# EAGLE design io_rtc_ide (EAGLE 5.11)
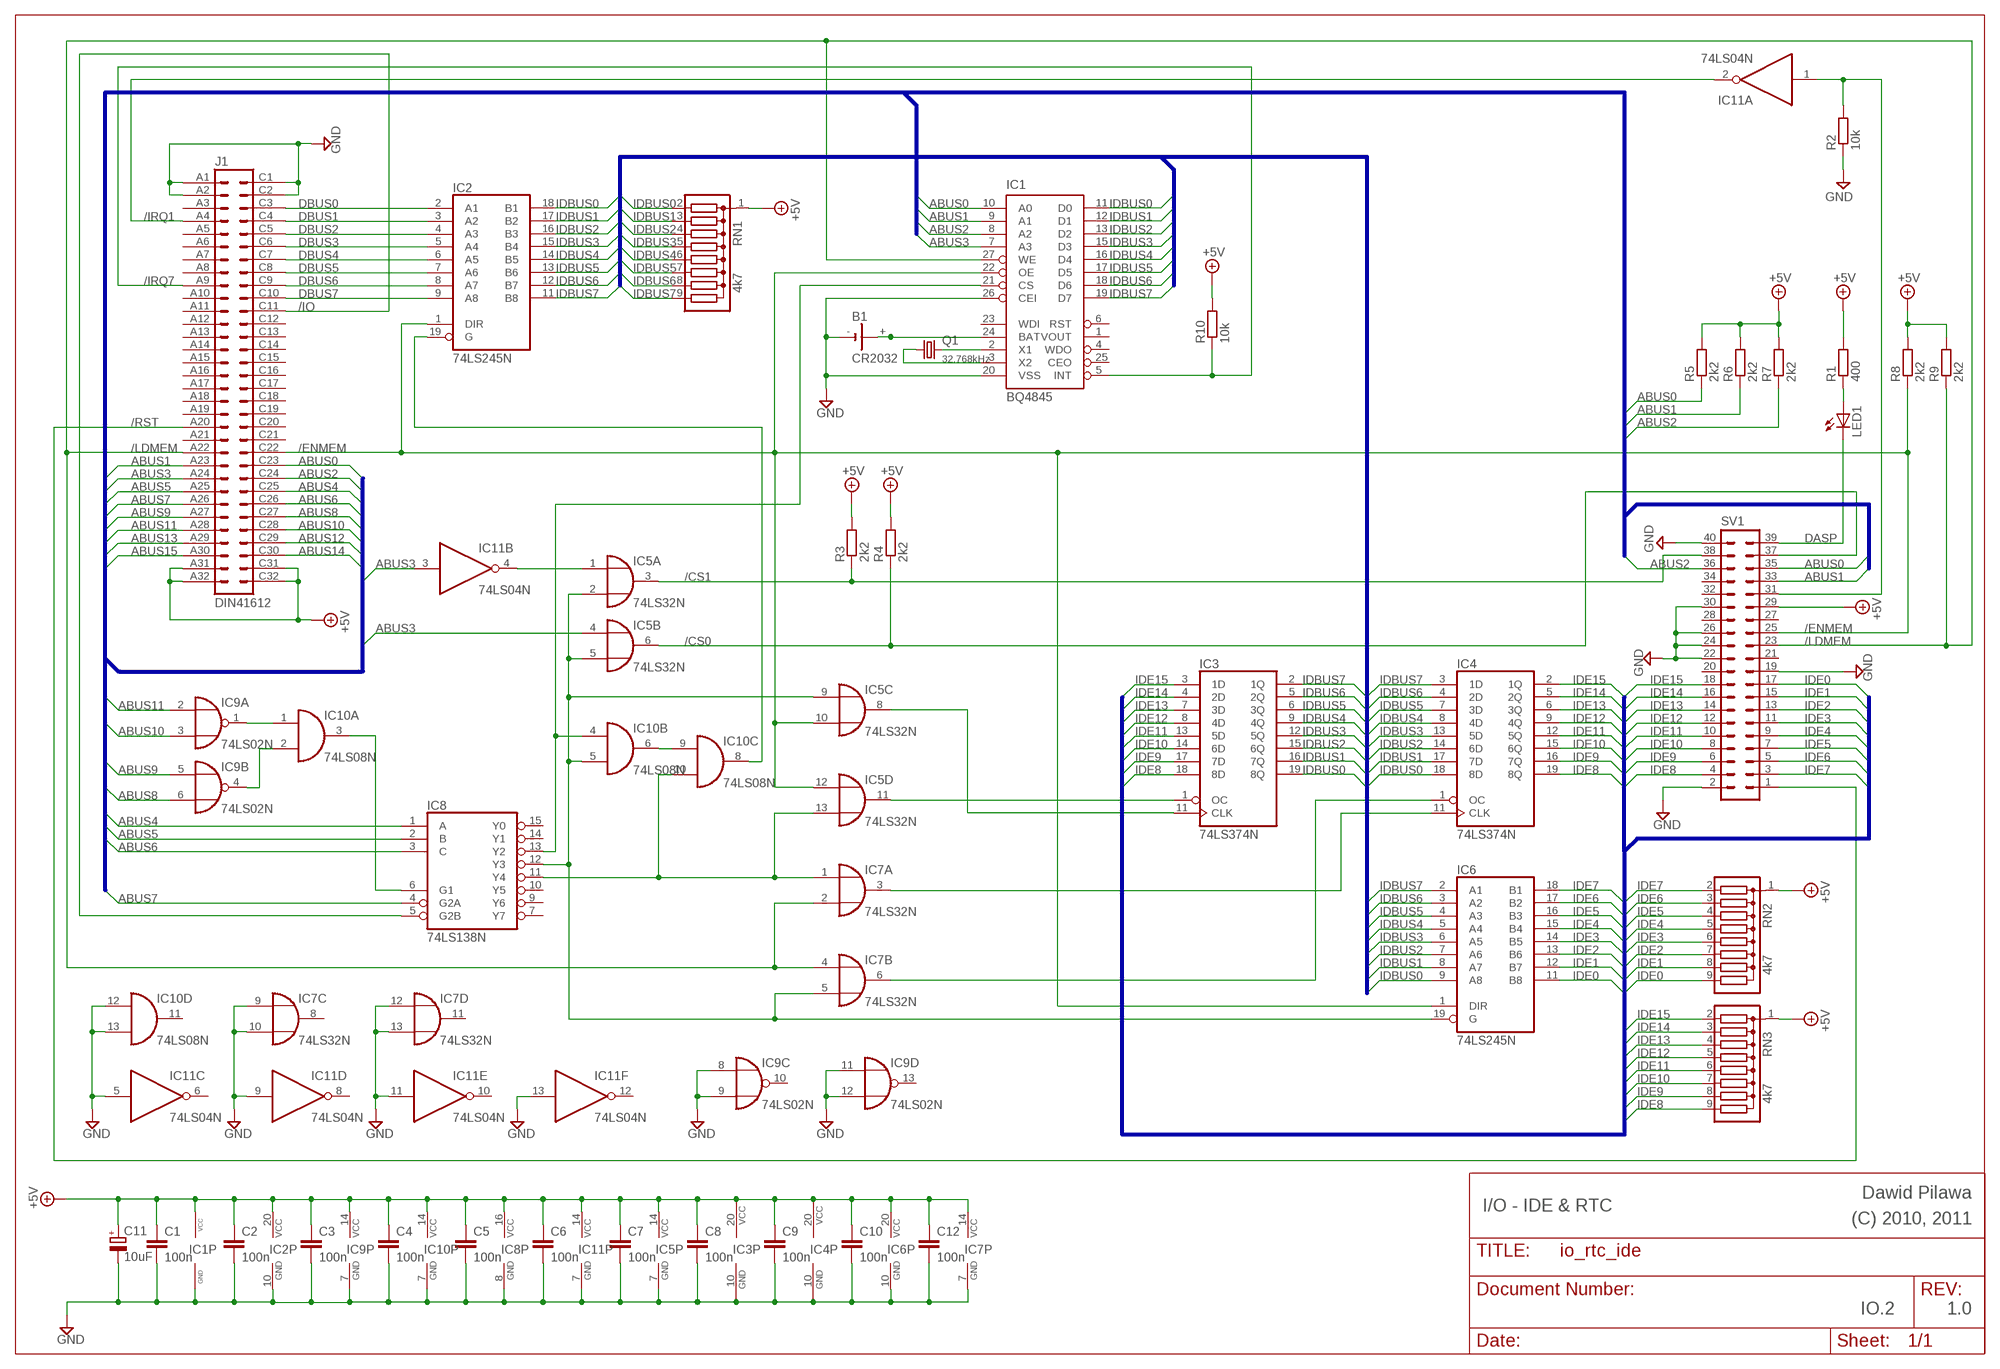
[diagram p0: schematic, sheet 1]

## Parts
B1  CR2032  [CR2032]
C1  100n  C-EU050-024X044  [C050-024X044]
C2  100n  C-EU050-024X044  [C050-024X044]
C3  100n  C-EU050-024X044  [C050-024X044]
C4  100n  C-EU050-024X044  [C050-024X044]
C5  100n  C-EU050-024X044  [C050-024X044]
C6  100n  C-EU050-024X044  [C050-024X044]
C7  100n  C-EU050-024X044  [C050-024X044]
C8  100n  C-EU050-024X044  [C050-024X044]
C9  100n  C-EU050-024X044  [C050-024X044]
C10  100n  C-EU050-024X044  [C050-024X044]
C11  10uF  CPOL-EUE5-5  [E5-5]
C12  100n  C-EU050-024X044  [C050-024X044]
IC1  BQ4845  BQ4845DIL28-6  [DIL28-6]
IC2  74LS245N  [DIL20]
IC3  74LS374N  [DIL20]
IC4  74LS374N  [DIL20]
IC5  74LS32N  [DIL14]
IC6  74LS245N  [DIL20]
IC7  74LS32N  [DIL14]
IC8  74LS138N  [DIL16]
IC9  74LS02N  [DIL14]
IC10  74LS08N  [DIL14]
IC11  74LS04N  [DIL14]
J1  DIN41612  VG64B  [VG64B]
LED1  LED5MM  [LED5MM]
Q1  32.768kHz  CRYSTALTC26H  [TC26H]
R1  400  R-EU_0204/7  [0204/7]
R2  10k  R-EU_0204/7  [0204/7]
R3  2k2  R-EU_0204/7  [0204/7]
R4  2k2  R-EU_0204/7  [0204/7]
R5  2k2  R-EU_0204/7  [0204/7]
R6  2k2  R-EU_0204/7  [0204/7]
R7  2k2  R-EU_0204/7  [0204/7]
R8  2k2  R-EU_0204/7  [0204/7]
R9  2k2  R-EU_0204/7  [0204/7]
R10  10k  R-EU_0204/7  [0204/7]
RN1  4k7  G08R  [SIL9]
RN2  4k7  G08R  [SIL9]
RN3  4k7  G08R  [SIL9]
SV1  ML40  [ML40]

## Nets
+5V: C1.1 C2.1 C3.1 C4.1 C5.1 C6.1 C7.1 C8.1 C9.1 C10.1 C11.+ C12.1 IC1.28(VCC) IC2.20(VCC) IC3.20(VCC) IC4.20(VCC) IC5.14(P:VCC) IC6.20(VCC) IC7.14(P:VCC) IC8.16(VCC) IC9.14(P:VCC) IC10.14(P:VCC) IC11.14(P:VCC) J1.A31 J1.A32 J1.C31 J1.C32 R1.2 R3.2 R4.2 R5.2 R6.2 R7.2 R8.2 R9.2 R10.2 RN1.1 RN2.1 RN3.1 SV1.29
/CS0: IC5.6(B:O) R4.1 SV1.37
/CS1: IC5.3(A:O) R3.1 SV1.38
/ENMEM: IC1.22(OE) IC2.1(DIR) IC5.10(C:I1) IC5.12(D:I0) IC6.1(DIR) J1.C22 R8.1 SV1.25
/IO: IC8.5(G2B) J1.C11
/IRQ1: IC11.2(A:O) J1.A4
/IRQ7: IC1.5(INT) J1.A9 R10.1
/LDMEM: IC1.27(WE) IC7.2(A:I1) IC7.4(B:I0) J1.A22 R9.1 SV1.23
/RST: J1.A20 SV1.1
ABUS0: IC1.10(A0) J1.C23 R5.1 SV1.35
ABUS1: IC1.9(A1) J1.A23 R6.1 SV1.33
ABUS2: IC1.8(A2) J1.C24 R7.1 SV1.36
ABUS3: IC1.7(A3) IC5.4(B:I0) IC11.3(B:I) J1.A24
ABUS4: IC8.1(A) J1.C25
ABUS5: IC8.2(B) J1.A25
ABUS6: IC8.3(C) J1.C26
ABUS7: IC8.4(G2A) J1.A26
ABUS8: IC9.6(B:I1) J1.C27
ABUS9: IC9.5(B:I0) J1.A27
ABUS10: IC9.3(A:I1) J1.C28
ABUS11: IC9.2(A:I0) J1.A28
ABUS12: J1.C29
ABUS13: J1.A29
ABUS14: J1.C30
ABUS15: J1.A30
DASP: LED1.K(C) SV1.39
DBUS0: IC2.2(A1) J1.C3
DBUS1: IC2.3(A2) J1.C4
DBUS2: IC2.4(A3) J1.C5
DBUS3: IC2.5(A4) J1.C6
DBUS4: IC2.6(A5) J1.C7
DBUS5: IC2.7(A6) J1.C8
DBUS6: IC2.8(A7) J1.C9
DBUS7: IC2.9(A8) J1.C10
GND: B1.- C1.2 C2.2 C3.2 C4.2 C5.2 C6.2 C7.2 C8.2 C9.2 C10.2 C11.- C12.2 IC1.14(GND) IC1.20(VSS) IC1.26(CEI) IC2.10(GND) IC3.10(GND) IC4.10(GND) IC5.7(P:GND) IC6.10(GND) IC7.7(P:GND) IC7.9(C:I0) IC7.10(C:I1) IC7.12(D:I0) IC7.13(D:I1) IC8.8(GND) IC9.7(P:GND) IC9.8(C:I0) IC9.9(C:I1) IC9.11(D:I0) IC9.12(D:I1) IC10.7(P:GND) IC10.12(D:I0) IC10.13(D:I1) IC11.5(C:I) IC11.7(P:GND) IC11.9(D:I) IC11.11(E:I) IC11.13(F:I) J1.A1 J1.A2 J1.C1 J1.C2 R2.1 SV1.2 SV1.19 SV1.22 SV1.24 SV1.26 SV1.30 SV1.40
IDBUS0: IC1.11(D0) IC2.18(B1) IC3.19(8Q) IC4.18(8D) IC6.9(A8) RN1.2
IDBUS1: IC1.12(D1) IC2.17(B2) IC3.16(7Q) IC4.17(7D) IC6.8(A7) RN1.3
IDBUS2: IC1.13(D2) IC2.16(B3) IC3.15(6Q) IC4.14(6D) IC6.7(A6) RN1.4
IDBUS3: IC1.15(D3) IC2.15(B4) IC3.12(5Q) IC4.13(5D) IC6.6(A5) RN1.5
IDBUS4: IC1.16(D4) IC2.14(B5) IC3.9(4Q) IC4.8(4D) IC6.5(A4) RN1.6
IDBUS5: IC1.17(D5) IC2.13(B6) IC3.6(3Q) IC4.7(3D) IC6.4(A3) RN1.7
IDBUS6: IC1.18(D6) IC2.12(B7) IC3.5(2Q) IC4.4(2D) IC6.3(A2) RN1.8
IDBUS7: IC1.19(D7) IC2.11(B8) IC3.2(1Q) IC4.3(1D) IC6.2(A1) RN1.9
IDE0: IC6.11(B8) RN2.9 SV1.17
IDE1: IC6.12(B7) RN2.8 SV1.15
IDE2: IC6.13(B6) RN2.7 SV1.13
IDE3: IC6.14(B5) RN2.6 SV1.11
IDE4: IC6.15(B4) RN2.5 SV1.9
IDE5: IC6.16(B3) RN2.4 SV1.7
IDE6: IC6.17(B2) RN2.3 SV1.5
IDE7: IC6.18(B1) RN2.2 SV1.3
IDE8: IC3.18(8D) IC4.19(8Q) RN3.9 SV1.4
IDE9: IC3.17(7D) IC4.16(7Q) RN3.8 SV1.6
IDE10: IC3.14(6D) IC4.15(6Q) RN3.7 SV1.8
IDE11: IC3.13(5D) IC4.12(5Q) RN3.6 SV1.10
IDE12: IC3.8(4D) IC4.9(4Q) RN3.5 SV1.12
IDE13: IC3.7(3D) IC4.6(3Q) RN3.4 SV1.14
IDE14: IC3.4(2D) IC4.5(2Q) RN3.3 SV1.16
IDE15: IC3.3(1D) IC4.2(1Q) RN3.2 SV1.18
N$1: B1.+ B1.+@1(+) IC1.24(BAT)
N$2: IC1.3(X2) Q1.1
N$3: IC1.21(CS) IC8.13(Y2) IC10.4(B:I0)
N$5: IC1.2(X1) Q1.2
N$6: IC2.19(G) IC10.8(C:O)
N$7: IC5.1(A:I0) IC11.4(B:O)
N$8: IC5.13(D:I1) IC7.1(A:I0) IC8.11(Y4) IC10.10(C:I1)
N$9: IC4.11(CLK) IC7.3(A:O)
N$10: IC11.1(A:I) R2.2 SV1.31
N$11: IC4.1(OC) IC7.6(B:O)
N$12: IC3.1(OC) IC5.11(D:O)
N$13: IC3.11(CLK) IC5.8(C:O)
N$14: IC10.6(B:O) IC10.9(C:I0)
N$15: LED1.A R1.1
N$16: IC5.2(A:I1) IC5.5(B:I1) IC5.9(C:I0) IC6.19(G) IC7.5(B:I1) IC8.12(Y3) IC10.5(B:I1)
N$22: IC9.1(A:O) IC10.1(A:I0)
N$26: IC9.4(B:O) IC10.2(A:I1)
N$27: IC8.6(G1) IC10.3(A:O)
Unconnected: IC1.1(VOUT) IC1.4(WDO) IC1.6(RST) IC1.23(WDI) IC1.25(CEO) IC7.8(C:O) IC7.11(D:O) IC8.7(Y7) IC8.9(Y6) IC8.10(Y5) IC8.14(Y1) IC8.15(Y0) IC9.10(C:O) IC9.13(D:O) IC10.11(D:O) IC11.6(C:O) IC11.8(D:O) IC11.10(E:O) IC11.12(F:O) J1.A3 J1.A5 J1.A6 J1.A7 J1.A8 J1.A10 J1.A11 J1.A12 J1.A13 J1.A14 J1.A15 J1.A16 J1.A17 J1.A18 J1.A19 J1.A21 J1.C12 J1.C13 J1.C14 J1.C15 J1.C16 J1.C17 J1.C18 J1.C19 J1.C20 J1.C21 SV1.20 SV1.21 SV1.27 SV1.28 SV1.32 SV1.34

## Buses
IDBUS[0..7]
ABUS[0..15]
IDE[0..15]

## Notes on the sheet
- Dawid Pilawa
- I/O - IDE & RTC | (C) 2010, 2011
- IO.2 | 1.0

## Library data of the parts
B1 = dawid:CR2032: CR2032 3V Cell Battery
C1-C10 C12 = rcl:C-EU: CAPACITOR, European symbol
C11 = rcl:CPOL-EU: POLARIZED CAPACITOR, European symbol
IC1 = dawid:BQ4845: bq4846 Real Time Clock
IC2 IC6 = 74xx-eu:74*245: Octal BUS TRANSCEIVER, 3-state
IC3 IC4 = 74xx-us:74*374: Octal D type transparent LATCH, edge triggered
IC5 IC7 = 74xx-eu:74*32: Quad 2-input OR gate
IC8 = 74xx-eu:74*138: 3-line to 8-line DECODER/DEMULTIPLEXER
IC9 = 74xx-eu:74*02: Quad 2-input NOR gate
IC10 = 74xx-eu:74*08: Quad 2-input AND gate
IC11 = 74xx-eu:74*04: Hex INVERTER
J1 = 19inch:VG64: PCB EUROCARD, 64-pin type C/AC, 2.54 mm
LED1 = led:LED: LED OSRAM: - CHIPLED LG R971, LG N971, LY N971, LG Q971, LY Q971, LO R971, LY R971 LH N974, LH R974 LS Q976, LO Q976, LY Q976 LO Q996 - Hyper CHIPLED LW Q18S LB Q993, LB Q99A, LB R99A - SideLED LS A670, LO A670, LY A670, LG A670, LP A670 LB A673, LV A673, LT A673, LW A673 LH A674 LY A675 LS A676, LA A676, LO A676, LY A676, LW A676 LS A679, LY A679, LG A679 - Hyper Micro SIDELED® LS Y876, LA Y876, LO Y876, LY Y876 LT Y87S - SmartLED LW L88C, LW L88S LB L89C, LB L89S, LG L890 LS L89K, LO L89K, LY L89K LS L896, LA L896, LO L896, LY L896 - TOPLED LS T670, LO T670, LY T670, LG T670, LP T670 LSG T670, LSP T670, LSY T670, LOP T670, LYG T670 LG T671, LOG T671, LSG T671 LB T673, LV T673, LT T673, LW T673 LH T674 LS T676, LA T676, LO T676, LY T676, LB T676, LH T676, LSB T676, LW T676 LB T67C, LV T67C, LT T67C, LS T67K, LO T67K, LY T67K, LW E67C LS E67B, LA E67B, LO E67B, LY E67B, LB E67C, LV E67C, LT E67C LW T67C LS T679, LY T679, LG T679 LS T770, LO T770, LY T770, LG T770, LP T770 LB T773, LV T773, LT T773, LW T773 LH T774 LS E675, LA E675, LY E675, LS T675 LS T776, LA T776, LO T776, LY T776, LB T776 LHGB T686 LT T68C, LB T68C - Hyper Mini TOPLED® LB M676 - Mini TOPLED Santana® LG M470 LS M47K, LO M47K, LY M47K Source: http://www.osram.convergy.de LUXEON: - LUMILED® LXK2-PW12-R00, LXK2-PW12-S00, LXK2-PW14-U00, LXK2-PW14-V00 LXK2-PM12-R00, LXK2-PM12-S00, LXK2-PM14-U00 LXK2-PE12-Q00, LXK2-PE12-R00, LXK2-PE12-S00, LXK2-PE14-T00, LXK2-PE14-U00 LXK2-PB12-K00, LXK2-PB12-L00, LXK2-PB12-M00, LXK2-PB14-N00, LXK2-PB14-P00, LXK2-PB14-Q00 LXK2-PR12-L00, LXK2-PR12-M00, LXK2-PR14-Q00, LXK2-PR14-R00 LXK2-PD12-Q00, LXK2-PD12-R00, LXK2-PD12-S00 LXK2-PH12-R00, LXK2-PH12-S00 LXK2-PL12-P00, LXK2-PL12-Q00, LXK2-PL12-R00 Source: www.luxeon.com KINGBRIGHT: KA-3528ASYC Source: www.kingbright.com
Q1 = crystal:CRYSTAL: CRYSTAL
R1-R10 = rcl:R-EU_: RESISTOR, European symbol
RN1-RN3 = resistor-sil:G08R: SIL RESISTOR
SV1 = con-ml:ML40: HARTING

## Board
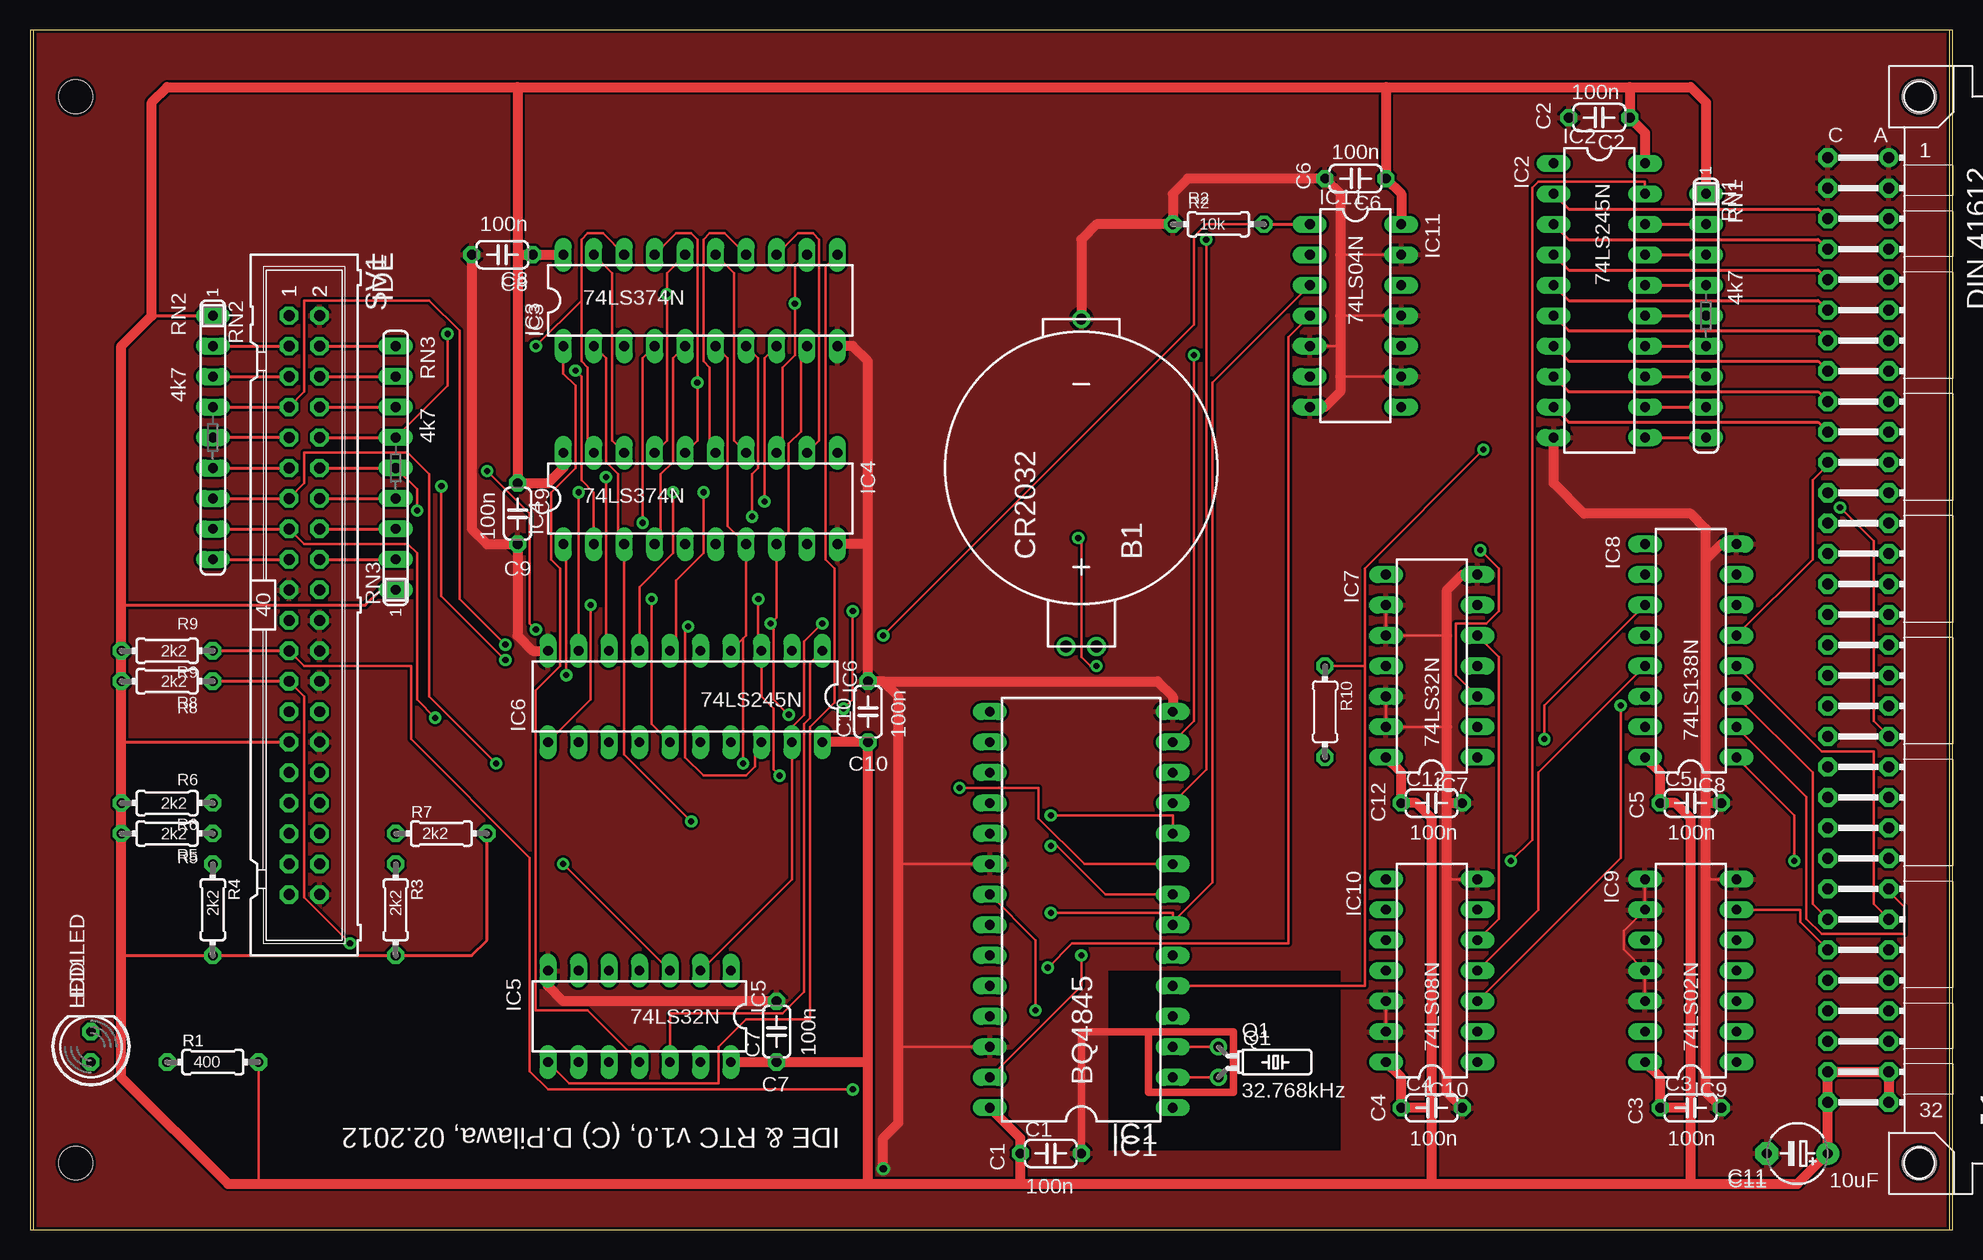
[diagram p1: board, top side]
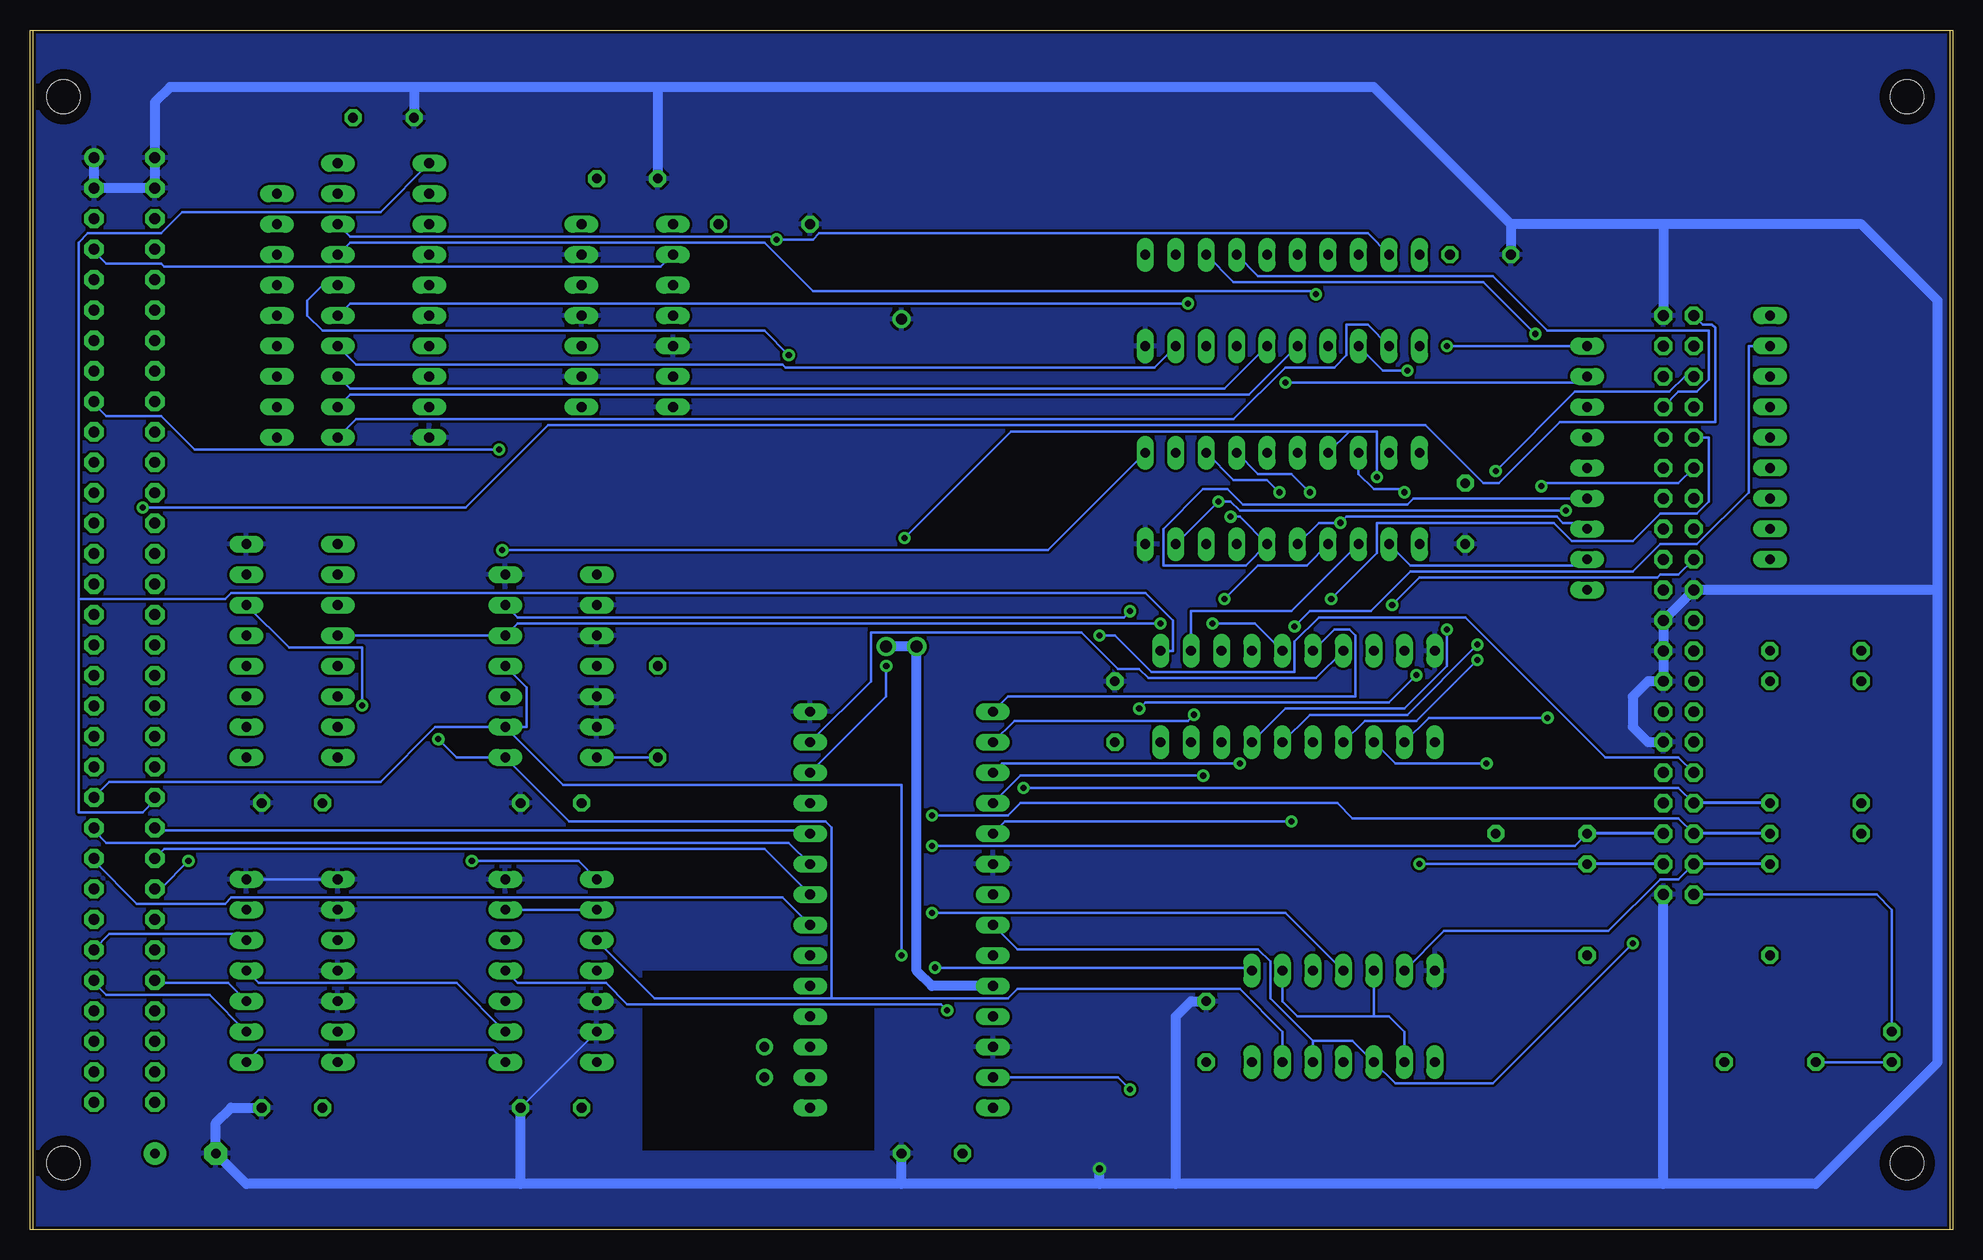
[diagram p2: board, bottom side, seen from below]

Size 160 x 100 mm. Coordinates in mm from the lower left corner, seen from the top.
Outline: 0,0 160,0 160,100 0,100 0,0
Copper layers (1*16): Top 0.035mm / dielectric 1.5mm / Bottom 0.035mm
Design rules "SparkFun": minimum track width 8mil, minimum drill 20mil, track to track 8mil, track to pad 8mil, pad to pad 8mil, via to via 8mil, smd to smd 8mil, copper to edge 10mil, drill to drill 8mil, minimum pad ring 12mil, minimum via ring 10mil, stop-mask expansion 4mil, vias tented up to drill 25mil, thermal gap 10mil
tRestrict: area 89.9,6.6 to 109.2,21.6
bRestrict: area 89.9,6.6 to 109.2,21.6

### Footprints (pad centres in the part's own frame; a part is rotated, then mirrored left to right if it is on the bottom)
CR2032 = drill 1 round: + -14.884,-1.27; +@1 -14.884,1.27 | drill 0.9 round: - 12.421,0
C050-024X044 = drill 0.813 octagon: 1 -2.54,0; 2 2.54,0
E5-5 = drill 0.813 pad 1.905 round: + -2.54,0 | drill 0.813 pad 1.905 octagon: - 2.54,0
DIL28-6 = drill 0.813 long: 1 -16.51,-7.62; 2 -13.97,-7.62; 3 -11.43,-7.62; 4 -8.89,-7.62; 5 -6.35,-7.62; 6 -3.81,-7.62; 7 -1.27,-7.62; 8 1.27,-7.62; 9 3.81,-7.62; 10 6.35,-7.62; 11 8.89,-7.62; 12 11.43,-7.62; 13 13.97,-7.62; 14 16.51,-7.62; 15 16.51,7.62; 16 13.97,7.62; 17 11.43,7.62; 18 8.89,7.62; 19 6.35,7.62; 20 3.81,7.62; 21 1.27,7.62; 22 -1.27,7.62; 23 -3.81,7.62; 24 -6.35,7.62; 25 -8.89,7.62; 26 -11.43,7.62; 27 -13.97,7.62; 28 -16.51,7.62
DIL20 = drill 0.813 long: 1 -11.43,-3.81; 2 -8.89,-3.81; 3 -6.35,-3.81; 4 -3.81,-3.81; 5 -1.27,-3.81; 6 1.27,-3.81; 7 3.81,-3.81; 8 6.35,-3.81; 9 8.89,-3.81; 10 11.43,-3.81; 11 11.43,3.81; 12 8.89,3.81; 13 6.35,3.81; 14 3.81,3.81; 15 1.27,3.81; 16 -1.27,3.81; 17 -3.81,3.81; 18 -6.35,3.81; 19 -8.89,3.81; 20 -11.43,3.81
DIL14 = drill 0.813 long: 1 -7.62,-3.81; 2 -5.08,-3.81; 3 -2.54,-3.81; 4 0,-3.81; 5 2.54,-3.81; 6 5.08,-3.81; 7 7.62,-3.81; 8 7.62,3.81; 9 5.08,3.81; 10 2.54,3.81; 11 0,3.81; 12 -2.54,3.81; 13 -5.08,3.81; 14 -7.62,3.81
DIL16 = drill 0.813 long: 1 -8.89,-3.81; 2 -6.35,-3.81; 3 -3.81,-3.81; 4 -1.27,-3.81; 5 1.27,-3.81; 6 3.81,-3.81; 7 6.35,-3.81; 8 8.89,-3.81; 9 8.89,3.81; 10 6.35,3.81; 11 3.81,3.81; 12 1.27,3.81; 13 -1.27,3.81; 14 -3.81,3.81; 15 -6.35,3.81; 16 -8.89,3.81
VG64B = drill 0.914 pad 1.6 round: A1 154.94,39.37 | drill 0.914 pad 1.6 octagon: A2 154.94,36.83; A3 154.94,34.29; A4 154.94,31.75; A5 154.94,29.21; A6 154.94,26.67; A7 154.94,24.13; A8 154.94,21.59; A9 154.94,19.05; A10 154.94,16.51; A11 154.94,13.97; A12 154.94,11.43; A13 154.94,8.89; A14 154.94,6.35; A15 154.94,3.81; A16 154.94,1.27; A17 154.94,-1.27; A18 154.94,-3.81; A19 154.94,-6.35; A20 154.94,-8.89; A21 154.94,-11.43; A22 154.94,-13.97; A23 154.94,-16.51; A24 154.94,-19.05; A25 154.94,-21.59; A26 154.94,-24.13; A27 154.94,-26.67; A28 154.94,-29.21; A29 154.94,-31.75; A30 154.94,-34.29; A31 154.94,-36.83; A32 154.94,-39.37; C1 149.86,39.37; C2 149.86,36.83; C3 149.86,34.29; C4 149.86,31.75; C5 149.86,29.21; C6 149.86,26.67; C7 149.86,24.13; C8 149.86,21.59; C9 149.86,19.05; C10 149.86,16.51; C11 149.86,13.97; C12 149.86,11.43; C13 149.86,8.89; C14 149.86,6.35; C15 149.86,3.81; C16 149.86,1.27; C17 149.86,-1.27; C18 149.86,-3.81; C19 149.86,-6.35; C20 149.86,-8.89; C21 149.86,-11.43; C22 149.86,-13.97; C23 149.86,-16.51; C24 149.86,-19.05; C25 149.86,-21.59; C26 149.86,-24.13; C27 149.86,-26.67; C28 149.86,-29.21; C29 149.86,-31.75; C30 149.86,-34.29; C31 149.86,-36.83; C32 149.86,-39.37 | hole 2.794: 157.48,44.45; 157.48,-44.45; 3.81,-44.45; 3.81,44.45
LED5MM = drill 0.813 octagon: A -1.27,0; K 1.27,0
TC26H = drill 0.813 round: 1 -1.27,0; 2 1.27,0
0204/7 = drill 0.813 octagon: 1 -3.81,0; 2 3.81,0
SIL9 = drill 0.813 long: 1 -10.16,0; 2 -7.62,0; 3 -5.08,0; 4 -2.54,0; 5 0,0; 6 2.54,0; 7 5.08,0; 8 7.62,0; 9 10.16,0
ML40 = drill 0.914 octagon: 1 -24.13,-1.27; 2 -24.13,1.27; 3 -21.59,-1.27; 4 -21.59,1.27; 5 -19.05,-1.27; 6 -19.05,1.27; 7 -16.51,-1.27; 8 -16.51,1.27; 9 -13.97,-1.27; 10 -13.97,1.27; 11 -11.43,-1.27; 12 -11.43,1.27; 13 -8.89,-1.27; 14 -8.89,1.27; 15 -6.35,-1.27; 16 -6.35,1.27; 17 -3.81,-1.27; 18 -3.81,1.27; 19 -1.27,-1.27; 20 -1.27,1.27; 21 1.27,-1.27; 22 1.27,1.27; 23 3.81,-1.27; 24 3.81,1.27; 25 6.35,-1.27; 26 6.35,1.27; 27 8.89,-1.27; 28 8.89,1.27; 29 11.43,-1.27; 30 11.43,1.27; 31 13.97,-1.27; 32 13.97,1.27; 33 16.51,-1.27; 34 16.51,1.27; 35 19.05,-1.27; 36 19.05,1.27; 37 21.59,-1.27; 38 21.59,1.27; 39 24.13,-1.27; 40 24.13,1.27

### Placement (x,y rotation side)
B1  87.63,63.5 90 top
C1  85.09,6.35 0 top
C2  130.81,92.71 180 top
C3  138.43,10.16 0 top
C4  116.84,10.16 0 top
C5  138.43,35.56 0 top
C6  110.49,87.63 180 top
C7  62.23,16.51 90 top
C8  39.37,81.28 180 top
C9  40.64,59.69 270 top
C10  69.85,43.18 90 top
C11  147.32,6.35 180 top
C12  116.84,35.56 0 top
IC1  87.63,26.67 90 top
IC2  130.81,77.47 270 top
IC3  55.88,77.47 0 top
IC4  55.88,60.96 0 top
IC5  50.8,17.78 180 top
IC6  54.61,44.45 180 top
IC7  116.84,46.99 90 top
IC8  138.43,48.26 90 top
IC9  138.43,21.59 90 top
IC10  116.84,21.59 90 top
IC11  110.49,76.2 270 top
J1  0,50 0 top
LED1  5.08,15.24 90 top
Q1  99.06,13.97 270 top
R1  15.24,13.97 0 top
R2  99.06,83.82 0 top
R3  30.48,26.67 270 top
R4  15.24,26.67 270 top
R5  11.43,33.02 180 top
R6  11.43,35.56 180 top
R7  34.29,33.02 0 top
R8  11.43,45.72 180 top
R9  11.43,48.26 180 top
R10  107.95,43.18 270 top
RN1  139.7,76.2 270 top
RN2  15.24,66.04 270 top
RN3  30.48,63.5 90 top
SV1  22.86,52.07 270 top

### Tracks (layer width: path | path; a pad name or v marks a point on that pad's centre or on a via)
+5V
  Top 0.203: 19.05,3.81 R1.2
  Top 0.254: 7.62,22.86 R4.2 R3.2 36.83,22.86 38.1,24.13 R7.2 | 7.62,40.64 SV1.29 | 10.16,76.2 RN2.1 | RN3.1 29.21,53.34 27.94,52.07 7.62,52.07
  Top 0.813: 69.85,3.81 19.05,3.81 16.51,3.81 7.62,12.7 7.62,22.86 R5.2 R6.2 7.62,40.64 R8.2 R9.2 7.62,52.07 7.62,73.66 10.16,76.2 10.16,93.98 11.43,95.25 40.64,95.25 | 69.85,3.81 82.55,3.81 | 82.55,3.81 116.84,3.81 | 116.84,3.81 138.43,3.81 | 138.43,3.81 147.32,3.81 C11.+ J1.C32 J1.C31 J1.A31 J1.A32 | 40.64,95.25 113.03,95.25 | IC2.20 134.62,91.44 C2.1 133.35,95.25 | 138.43,3.81 138.43,10.16 | 138.43,10.16 138.43,34.29 137.16,35.56 C5.1 135.89,38.1 IC8.16 | 138.43,10.16 C3.1 135.89,12.7 IC9.14 | 116.84,3.81 116.84,10.16 | 116.84,10.16 116.84,34.29 115.57,35.56 C12.1 114.3,38.1 IC7.14 | 116.84,10.16 C4.1 114.3,12.7 IC10.14 | 82.55,3.81 C1.1 82.55,7.62 IC1.28 | 69.85,3.81 69.85,13.97 | 69.85,13.97 C10.1 IC6.20 | 69.85,13.97 C7.1 IC5.14 | 40.64,95.25 40.64,81.28 | 40.64,81.28 C9.1 43.18,62.23 44.45,63.5 IC4.20 | 40.64,81.28 C8.1 IC3.20 | 113.03,95.25 C6.1 114.3,86.36 IC11.14 | RN1.1 139.7,93.98 138.43,95.25 133.35,95.25 | 113.03,95.25 133.35,95.25
  Bottom 0.203: IC7.14 R10.2
/CS0
  Bottom 0.203: IC5.6 42.42,24.89 28.7,24.89 24.38,29.21 22.86,29.21 SV1.37
  Bottom 0.254: R4.1 SV1.37
/CS1  (via drill 0.51)
  Top 0.203: v44.45,30.48 IC5.3
  Bottom 0.203: R3.1 v44.45,30.48
  Bottom 0.254: SV1.38 R3.1
/ENMEM  (via drill 0.51)
  Top 0.203: IC6.1 65.02,47.24 65.02,42.67 64.52,42.16 64.52,19.81 62.74,18.03 53.34,18.03 IC5.12 | SV1.25 22.86,44.45 22.86,27.69 v26.67,23.88
  Top 0.254: SV1.25 R8.1
  Bottom 0.203: IC2.1 131.06,84.84 147.57,84.84 149.35,83.06 155.45,83.06 156.21,82.3 156.21,52.58 | 156.21,52.58 156.21,34.8 150.88,34.8 149.86,35.81 J1.C22 | IC1.22 77.98,23.37 57.91,23.37 56.9,22.35 56.9,19.3 53.34,15.75 | 53.34,15.75 50.04,15.75 IC5.10 46.48,12.19 38.35,12.19 v26.67,23.88 | 156.21,52.58 144.02,52.58 143.51,53.09 67.31,53.09 65.02,50.8 65.02,48.26 IC6.1 | 53.34,15.75 IC5.12
/IO
  Top 0.203: IC8.5 148.59,55.88 148.59,62.48 149.86,63.75 J1.C11
/IRQ1
  Bottom 0.203: IC11.2 107.7,80.26 149.1,80.26 149.35,80.52 153.92,80.52 154.94,81.53 J1.A4
/IRQ7  (via drill 0.51)
  Top 0.203: IC1.5 111.25,20.32 111.25,46.99 | 111.25,46.99 111.25,55.12 v121.16,65.02 | 111.25,46.99 R10.1
  Bottom 0.203: v121.16,65.02 146.56,65.02 149.35,67.82 153.92,67.82 154.94,68.83 J1.A9
/LDMEM  (via drill 0.51)
  Top 0.203: IC1.27 87.63,20.32 v87.63,22.86 | SV1.23 22.86,46.99 31.75,46.99 31.75,40.89 41.66,30.99 41.66,13.21 43.18,11.68 v68.58,11.68
  Top 0.254: SV1.23 R9.1
  Bottom 0.203: v87.63,22.86 87.63,37.08 115.82,37.08 IC7.2 | IC7.4 118.87,45.21 118.87,41.91 IC7.2 | IC7.2 126.49,41.91 131.06,37.34 153.67,37.34 154.94,36.07 J1.A22 | v68.58,11.68 69.6,12.7 IC1.27
/RST  (via drill 0.51)
  Top 0.203: v150.88,60.2 153.67,57.4 153.67,42.42 154.94,41.15 J1.A20
  Bottom 0.203: SV1.1 20.83,75.44 20.07,75.44 19.81,75.18 19.81,67.31 32.77,67.31 37.85,62.23 39.12,62.23 43.94,67.06 117.09,67.06 123.95,60.2 v150.88,60.2
ABUS0  (via drill 0.51)
  Top 0.203: v85.09,34.54 95.25,34.54 IC1.10
  Bottom 0.203: IC1.10 95.5,33.27 149.86,33.27 J1.C23 | SV1.35 22.86,34.29 50.04,34.29 51.31,35.56 77.72,35.56 78.74,34.54 v85.09,34.54
  Bottom 0.254: R5.1 SV1.35
ABUS1  (via drill 0.51)
  Top 0.203: v77.47,36.83 84.07,36.83 84.07,34.29 87.88,30.48 IC1.9
  Bottom 0.203: IC1.9 97.03,32.26 153.92,32.26 154.94,33.27 J1.A23 | SV1.33 22.86,36.83 v77.47,36.83
  Bottom 0.254: R6.1 SV1.33
ABUS2  (via drill 0.51)
  Top 0.203: v85.09,32 85.6,32 89.66,27.94 IC1.8
  Bottom 0.203: IC1.8 99.06,31.75 149.1,31.75 149.86,30.99 J1.C24 | R7.1 31.5,32 v85.09,32
  Bottom 0.254: SV1.36 R7.1
ABUS3  (via drill 0.51)
  Top 0.203: v85.09,26.42 95.25,26.42 95.25,25.65 | IC11.3 98.55,70.61 98.55,28.96 95.25,25.65 | 95.25,25.65 IC1.7
  Bottom 0.203: IC5.4 55.63,26.42 v85.09,26.42 | IC1.7 97.54,27.69 143.51,27.69 144.02,27.18 151.38,27.18 154.94,30.73 J1.A24
ABUS4  (via drill 0.51)
  Top 0.203: IC8.1 147.07,34.54 v147.07,30.73
  Bottom 0.203: v147.07,30.73 149.35,28.45 149.86,28.45 J1.C25
ABUS5
  Top 0.203: IC8.2 148.08,36.07 148.08,25.91 149.35,24.64 156.21,24.64 156.21,26.92 154.94,28.19 J1.A25
ABUS6
  Top 0.203: IC8.3 148.59,38.1 148.59,27.18 149.86,25.91 J1.C26
ABUS7
  Top 0.203: IC8.4 149.35,39.88 153.67,39.88 153.67,27.18 154.94,25.91 J1.A26
ABUS8
  Top 0.203: IC9.6 147.57,26.67 147.57,25.65 149.86,23.37 J1.C27
ABUS9
  Bottom 0.203: IC9.5 142.75,24.64 153.67,24.64 154.94,23.37 J1.A27
ABUS10
  Bottom 0.203: IC9.3 143.76,20.57 149.86,20.57 J1.C28
ABUS11
  Bottom 0.203: IC9.2 145.29,19.56 153.92,19.56 154.94,20.57 J1.A28
DASP
  Bottom 0.203: LED1.K 5.08,26.67 6.35,27.94 SV1.39
DBUS0
  Top 0.254: IC2.2 128.27,85.09 149.06,85.09 J1.C3
DBUS1
  Top 0.254: IC2.3 128.27,82.55 149.06,82.55 J1.C4
DBUS2
  Top 0.254: IC2.4 128.27,80.01 149.06,80.01 J1.C5
DBUS3
  Top 0.254: IC2.5 128.27,77.47 149.06,77.47 J1.C6
DBUS4
  Top 0.254: IC2.6 128.27,74.93 149.06,74.93 J1.C7
DBUS5
  Top 0.254: IC2.7 128.27,72.39 149.06,72.39 J1.C8
DBUS6
  Top 0.254: IC2.8 128.27,69.85 149.06,69.85 J1.C9
DBUS7
  Top 0.254: IC2.9 128.27,67.31 149.06,67.31 J1.C10
GND  (via drill 0.6)
  Top 0.203: IC9.12 IC9.11 132.84,23.37 132.84,24.89 IC9.9 IC9.8 | IC7.9 IC7.10 118.11,49.53 | IC7.12 IC7.13 118.11,41.91 | IC10.13 IC10.12 | 72.39,15.24 IC1.26 | 118.11,29.21 IC10.7 | 72.39,30.48 IC1.20 | 109.22,73.66 IC11.5 | 109.22,71.12 IC11.9 | 109.22,76.2 IC11.11 | 109.22,81.28 IC11.13 | 139.7,29.21 IC9.7
  Top 0.61: 93.22,16.51 87.63,16.51 C1.2 | 93.22,16.51 100.33,16.51 100.33,11.43 93.22,11.43 93.22,16.51
  Top 0.813: 71.12,45.72 C10.2 69.85,57.15 | 71.12,45.72 72.39,44.45 72.39,30.48 72.39,15.24 72.39,8.89 71.12,7.62 v71.12,5.08 | C4.2 118.11,11.43 118.11,29.21 118.11,35.56 | 118.11,35.56 118.11,41.91 118.11,49.53 118.11,53.34 119.38,54.61 IC7.7 | 118.11,35.56 C12.2 | C3.2 139.7,11.43 139.7,29.21 139.7,35.56 | 139.7,35.56 139.7,55.88 | 139.7,55.88 140.97,57.15 IC8.8 | 139.7,35.56 C5.2 | IC2.10 127,62.23 129.54,59.69 138.43,59.69 139.7,58.42 139.7,55.88 | IC1.14 95.25,44.45 93.98,45.72 71.12,45.72 | 69.85,57.15 69.85,72.39 68.58,73.66 IC3.10 | 69.85,57.15 IC4.10 | C8.2 36.83,58.42 38.1,57.15 C9.2 40.64,49.53 41.91,48.26 IC6.10 | C7.2 44.45,19.05 43.18,20.32 IC5.7 | IC11.7 107.95,68.58 109.22,69.85 109.22,71.12 109.22,73.66 109.22,76.2 109.22,81.28 109.22,86.36 C6.2 96.52,87.63 95.25,86.36 R2.1 88.9,83.82 87.63,82.55 B1.-
  Bottom 0.203: C4.2 IC10.13 | IC9.7 IC9.8
  Bottom 0.813: 107.95,95.25 48.26,95.25 36.83,83.82 | 107.95,95.25 128.27,95.25 | 128.27,95.25 148.59,95.25 149.86,93.98 J1.C1 J1.C2 J1.A2 J1.A1 | 24.13,83.82 7.62,83.82 1.27,77.47 1.27,53.34 | 24.13,83.82 36.83,83.82 | 1.27,53.34 1.27,13.97 11.43,3.81 24.13,3.81 | 24.13,3.81 64.77,3.81 | 64.77,3.81 71.12,3.81 | 71.12,3.81 87.63,3.81 | 87.63,3.81 119.38,3.81 | 119.38,3.81 142.24,3.81 C11.- 144.78,8.89 143.51,10.16 C3.2 | 128.27,95.25 C2.2 | 107.95,95.25 C6.2 | 36.83,83.82 C8.2 | 87.63,3.81 C1.2 | 119.38,3.81 C4.2 | 71.12,3.81 v71.12,5.08 | C7.2 63.5,19.05 64.77,17.78 64.77,3.81 | 24.13,83.82 SV1.2 | 1.27,53.34 SV1.19 SV1.22 SV1.24 SV1.26 25.4,45.72 26.67,44.45 26.67,41.91 25.4,40.64 SV1.30 | 24.13,3.81 SV1.40
  pour Top: 160,100 160,0 0,0 0,100
  pour Bottom: 160,100 160,0 0,0 0,100
IDBUS0  (via drill 0.51)
  Top 0.203: IC6.9 v45.72,61.47 | IC3.19 48.51,79.76 48.51,65.79 IC4.18 | IC1.11 98.04,38.35 v98.04,82.55
  Top 0.254: IC2.18 RN1.2
  Bottom 0.203: v45.72,61.47 45.97,61.72 48.26,61.72 49.53,62.99 IC4.18 | IC2.18 133.6,82.8 98.3,82.8 v98.04,82.55 95,82.55 94.49,83.06 48.77,83.06 IC3.19
IDBUS1  (via drill 0.51)
  Top 0.203: IC6.8 48.01,48.51 v48.01,62.74 | IC3.16 53.09,79.76 v53.09,77.98 53.09,65.79 IC4.17 | v88.9,46.99 88.39,46.99 87.63,47.75 87.63,57.4 v87.38,57.66
  Top 0.254: IC2.17 RN1.3
  Bottom 0.203: v48.01,62.74 48.01,66.55 50.29,66.55 | 50.29,66.55 IC4.17 | IC1.12 88.9,44.45 v88.9,46.99 | v87.38,57.66 78.49,66.55 50.29,66.55 | IC2.17 133.6,82.3 99.06,82.3 95,78.23 53.34,78.23 v53.09,77.98
IDBUS2  (via drill 0.51)
  Top 0.203: IC6.7 50.8,53.59 53.59,56.39 v53.59,61.47 | IC3.15 58.67,79.76 58.67,65.79 IC4.14 | v97.03,72.9 97.03,42.42 IC1.13
  Top 0.254: IC2.16 RN1.4
  Bottom 0.203: v53.59,61.47 55.12,62.99 57.91,62.99 IC4.14 | IC1.13 90.17,45.72 90.17,49.78 72.64,49.78 69.6,46.74 67.82,46.74 67.06,45.97 53.09,45.97 IC6.7 | IC2.16 135.89,78.74 137.16,77.47 137.16,76.2 135.89,74.93 99.06,74.93 v97.03,72.9
IDBUS3  (via drill 0.51)
  Top 0.203: IC4.13 62.74,65.28 62.74,71.88 63.75,72.9 v63.75,77.22 63.75,80.26 IC3.12 | IC6.6 53.85,48.77 53.85,54.1 56.13,56.39 v56.13,61.47
  Top 0.254: IC2.15 RN1.5
  Bottom 0.203: IC6.6 51.56,50.04 50.29,50.04 49.78,49.53 49.78,44.45 78.74,44.45 IC1.15 | IC2.15 133.6,77.22 v63.75,77.22 | v56.13,61.47 57.15,62.48 59.94,62.48 IC4.13
IDBUS4  (via drill 0.51)
  Top 0.203: 61.98,50.8 62.23,51.05 IC4.8 63.25,58.17 63.25,65.53 64.26,66.55 64.26,73.15 IC3.9 | v63.25,42.93 61.98,44.2 61.98,50.8 | 61.98,50.8 v61.72,50.55
  Top 0.254: IC2.14 RN1.6
  Bottom 0.203: IC6.5 58.17,50.55 v61.72,50.55 | IC1.16 78.23,42.42 63.75,42.42 v63.25,42.93 | IC2.14 133.1,72.14 97.54,72.14 97.28,71.88 66.55,71.88 IC3.9
IDBUS5  (via drill 0.51)
  Top 0.203: 59.44,49.28 59.69,49.53 IC4.7 58.17,58.67 58.17,72.64 IC3.6 | 59.44,49.28 IC6.4 | v59.44,38.86 59.44,49.28
  Top 0.254: IC2.13 RN1.7
  Bottom 0.203: IC1.17 79.25,38.86 v59.44,38.86 | IC2.13 133.6,70.1 60.71,70.1 IC3.6
IDBUS6  (via drill 0.51)
  Top 0.203: IC4.4 52.58,57.66 52.58,62.99 53.59,64.01 53.59,72.64 IC3.5 | v60.71,52.58 60.71,48.51 IC6.3 60.96,44.45 61.98,43.43 61.98,38.35 v62.48,37.85
  Top 0.254: IC2.12 RN1.8
  Bottom 0.203: v60.71,52.58 57.91,55.37 53.85,55.37 IC4.4 | IC1.18 77.72,37.85 v62.48,37.85 | IC2.12 133.6,69.6 58.67,69.6 IC3.5
IDBUS7  (via drill 0.51)
  Top 0.203: IC3.2 48.01,72.64 48.01,64.01 49.02,62.99 49.02,57.66 IC4.3 49.53,39.62 v55.12,34.04
  Top 0.254: IC2.11 RN1.9
  Bottom 0.203: IC1.19 78.99,34.04 v55.12,34.04 | IC6.2 63.5,51.56 55.12,51.56 IC4.3 | IC2.11 133.1,67.56 59.94,67.56 55.63,71.88 51.56,71.88 50.55,72.9 50.55,75.44 48.77,75.44 IC3.2
IDE0  (via drill 0.51)
  Top 0.203: IC6.11 46.74,44.2 v46.74,52.07
  Top 0.254: RN2.9 SV1.17
  Bottom 0.203: v46.74,52.07 44.45,54.36 24.64,54.36 24.38,54.61 22.86,54.61 SV1.17
IDE1  (via drill 0.51)
  Top 0.203: v33.78,42.67 32.26,44.2 32.26,56.39 31.5,57.15 22.86,57.15 SV1.15
  Top 0.254: RN2.8 SV1.15
  Bottom 0.203: IC6.12 43.69,42.67 v33.78,42.67
IDE2  (via drill 0.51)
  Top 0.203: v38.86,38.86 33.27,44.45 33.27,62.99 31.5,64.77 22.86,64.77 22.86,62.23 SV1.13
  Top 0.254: RN2.7 SV1.13
  Bottom 0.203: IC6.13 46.48,38.86 v38.86,38.86
IDE3  (via drill 0.51)
  Top 0.203: v39.62,47.5 34.29,52.83 v34.29,61.98
  Top 0.254: RN2.6 SV1.11
  Bottom 0.203: IC6.14 49.02,42.42 44.7,42.42 v39.62,47.5 | v34.29,61.98 34.04,62.23 22.86,62.23 SV1.11
IDE4  (via drill 0.51)
  Top 0.203: IC6.15 51.82,42.16 v51.82,52.58
  Top 0.254: SV1.9 RN2.5
  Bottom 0.203: v51.82,52.58 48.01,56.39 48.01,58.93 33.27,58.93 31.75,57.4 26.67,57.4 24.38,59.69 21.34,59.69 20.32,60.71 20.32,66.04 SV1.9
IDE5  (via drill 0.51)
  Top 0.203: v39.62,48.77 35.81,52.58 35.81,74.93 33.27,77.47 22.86,77.47 22.86,69.85 SV1.7
  Top 0.254: RN2.4 SV1.7
  Bottom 0.203: IC6.16 53.59,42.93 45.47,42.93 v39.62,48.77
IDE6  (via drill 0.51)
  Top 0.203: v42.16,50.04 41.66,50.55 41.66,59.69 v38.1,63.25
  Top 0.254: RN2.3 SV1.5
  Bottom 0.203: IC6.17 55.63,43.43 45.72,43.43 42.16,46.99 v42.16,50.04 | v38.1,63.25 31.5,69.85 23.62,69.85 22.35,71.12 SV1.5
IDE7  (via drill 0.51)
  Top 0.203: IC6.18 60.45,40.13 60.45,38.61 59.69,37.85 56.13,37.85 54.61,39.37 54.61,50.04 v54.86,50.29
  Top 0.254: RN2.2 SV1.3
  Bottom 0.203: v54.86,50.29 53.59,51.56 48.51,51.56 45.21,54.86 26.67,54.86 24.38,57.15 21.34,57.15 17.02,61.47 17.02,73.66 RN2.2
IDE8  (via drill 0.51)
  Top 0.203: IC4.19 46.48,65.28 46.48,71.88 45.97,72.39 45.97,77.47 | 45.97,77.47 45.97,82.55 46.48,83.06 47.75,83.06 IC3.18 | v42.16,73.66 45.97,77.47
  Top 0.254: SV1.4 RN3.9
  Bottom 0.203: RN3.9 v42.16,73.66
IDE9  (via drill 0.51)
  Top 0.203: IC4.16 55.63,65.79 v55.63,70.61 55.63,82.55 55.12,83.06 53.85,83.06 IC3.17
  Top 0.254: SV1.6 RN3.8
  Bottom 0.203: RN3.8 30.99,70.61 v55.63,70.61
IDE10
  Top 0.203: IC4.15 56.64,65.28 56.64,71.88 56.13,72.39 56.13,82.55 56.64,83.06 57.91,83.06 IC3.14
  Top 0.254: SV1.8 RN3.7
  Bottom 0.203: SV1.8 22.86,69.85 21.34,69.85 20.32,70.87 20.32,74.93 33.78,74.93 38.35,79.5 57.91,79.5 IC3.14
IDE11  (via drill 0.51)
  Top 0.203: IC4.12 65.79,65.79 65.79,82.55 65.28,83.06 64.01,83.06 IC3.13 | RN3.6 34.8,70.36 v34.8,74.68
  Top 0.254: SV1.10 RN3.6
  Bottom 0.203: v34.8,74.68 39.12,78.99 59.94,78.99 IC3.13
IDE12  (via drill 0.51)
  Top 0.203: v61.21,60.71 61.21,72.64 IC3.8 | RN3.5 32.26,61.72 v32.26,59.94
  Top 0.254: SV1.12 RN3.5
  Bottom 0.203: IC4.9 v61.21,60.71 60.2,60.71 59.44,59.94 v32.26,59.94
IDE13  (via drill 0.51)
  Top 0.203: v60.2,59.44 60.2,62.99 60.71,63.5 60.71,72.64 IC3.7
  Top 0.254: SV1.14 RN3.4
  Bottom 0.203: v60.2,59.44 59.44,59.44 IC4.6 58.93,55.37 65.79,55.37 65.79,58.42 62.48,61.72 60.45,61.72 59.18,60.45 45.47,60.45 44.96,60.96 RN3.4
IDE14  (via drill 0.51)
  Top 0.203: IC3.4 51.05,72.64 v51.05,58.93
  Top 0.254: SV1.16 RN3.3
  Bottom 0.203: IC4.5 52.83,58.93 v51.05,58.93 50.55,59.44 33.02,59.44 32.51,58.93 30.99,58.93 RN3.3
IDE15  (via drill 0.51)
  Top 0.203: v45.47,71.63 45.97,71.12 45.97,62.48 46.99,61.47 IC4.2
  Top 0.254: SV1.18 RN3.2
  Bottom 0.203: IC4.2 45.21,55.37 30.99,55.37 RN3.2 | IC3.3 47.5,71.63 v45.47,71.63
N$1
  Bottom 0.813: B1.+ B1.+@1 86.36,21.59 85.09,20.32 IC1.24
N$2
  Top 0.203: IC1.3 Q1.1
N$3  (via drill 0.51)
  Top 0.203: IC1.21 83.82,24.13 v83.82,18.29 | IC8.13 125.73,38.1 125.73,26.67 IC10.4
  Bottom 0.203: v83.82,18.29 84.33,18.8 110.49,18.8 112.27,20.57 119.63,20.57 IC10.4
N$5
  Top 0.203: IC1.2 Q1.2
N$6  (via drill 0.51)
  Top 0.203: v123.44,30.73 125.22,32.51 125.22,86.87 125.73,87.38 134.62,87.38 IC2.19
  Bottom 0.203: IC10.8 114.55,30.73 v123.44,30.73
N$7  (via drill 0.51)
  Top 0.203: v84.84,21.84 86.87,23.88 104.9,23.88 104.9,74.42 IC11.4
  Bottom 0.203: IC5.1 58.67,21.84 v84.84,21.84
N$8  (via drill 0.51)
  Top 0.203: IC8.11 126.24,43.69 v126.24,40.89
  Bottom 0.203: 93.47,19.3 108.2,19.3 IC10.10 | 93.47,19.3 78.74,19.3 77.98,20.07 59.44,20.07 55.88,16.51 IC5.13 | 93.47,19.3 93.47,33.53 93.98,34.04 115.32,34.04 IC7.1 124.71,39.37 v126.24,40.89
N$9  (via drill 0.51)
  Top 0.203: v120.9,56.64 122.43,55.12 122.43,51.56 121.41,50.55 118.87,50.55 118.87,46.23 IC7.3
  Bottom 0.203: IC4.11 75.44,56.64 v120.9,56.64
N$10  (via drill 0.51)
  Top 0.203: v71.12,49.53 97.03,75.44 97.03,82.8 98.04,83.82 R2.2
  Top 0.254: R2.2 IC11.1
  Bottom 0.203: SV1.31 22.86,39.37 28.96,39.37 40.64,51.05 52.83,51.05 54.86,49.02 54.86,46.48 66.8,46.48 69.85,49.53 v71.12,49.53
N$11  (via drill 0.51)
  Top 0.203: IC4.1 44.7,56.9 v44.7,46.23 | v67.82,43.43 68.58,44.2 v68.58,51.56
  Bottom 0.203: v44.7,46.23 46.99,43.94 67.31,43.94 v67.82,43.43 | v68.58,51.56 69.09,51.05 119.63,51.05 IC7.6
N$12
  Top 0.203: IC5.11 46.48,18.29 42.16,18.29 42.16,44.96 44.2,46.99 44.2,55.12 43.43,55.88 43.43,61.47 45.47,63.5 45.47,70.36 44.45,71.37 IC3.1
N$13
  Top 0.203: IC5.8 44.96,12.19 57.4,12.19 57.4,15.24 59.69,17.53 65.02,17.53 65.02,41.91 67.06,43.94 67.06,55.12 66.29,55.88 66.29,80.26 IC3.11
N$14
  Bottom 0.203: IC10.9 IC10.6
N$15
  Bottom 0.203: LED1.A R1.1
N$16  (via drill 0.51)
  Top 0.203: IC10.5 122.43,25.91 122.43,47.75 IC7.5 | IC5.2 63.5,29.21 IC6.19 63.5,41.91 64.52,42.93 64.52,49.02 v66.04,50.55
  Bottom 0.203: IC8.12 IC7.5 119.63,50.55 v66.04,50.55 | IC5.9 45.72,16.51 46.99,17.78 48.26,17.78 | 48.26,17.78 54.61,17.78 55.88,19.05 IC5.2 | 48.26,17.78 IC5.5
N$22
  Bottom 0.203: IC10.1 121.67,14.99 141.22,14.99 IC9.1
N$26
  Bottom 0.203: IC10.2 124.71,20.57 141.22,20.57 IC9.4
N$27  (via drill 0.51)
  Top 0.203: IC10.3 132.59,30.99 v132.59,43.69
  Bottom 0.203: v132.59,43.69 132.59,48.51 138.68,48.51 IC8.6

### Text on the board
_tsilk: 100n | C2 | 100n | C6 | 1 | RN1 | IC2 | 74LS245N | R2 | 100n | 10k | 74LS04N | IDE | IC11 | C8 | 4k7 | 1 | 2 | 1 | 74LS374N | RN2 | RN3 | IC3 | 4k7 | 4k7 | IC4 | 100n | 74LS374N | IC8 | CR2032 | B1 | IC7 | C9 | R9 | 1 | 2k2 | 2k2 | 74LS245N | R8 | IC6 | 100n | 74LS138N | C10 | 74LS32N | R6 | 2k2 | 2k2 | R7 | C12 | C5 | 2k2 | R5 | 100n | 100n | IC10 | IC9 | R4 | R3 | 2k2 | 2k2 | HDD LED | IC5 | 74LS32N | Q1 | R1 | 74LS08N | 74LS02N | 100n | 400 | C7 | BQ4845 | 32.768kHz | C4 | C3 | IDE & RTC v1.0, (C) D.Pilawa, 02.2012 | IC1 | 100n | 100n | C1 | C11 | 10uF | 100n